# EAGLE schematic ESP32- 3.5 TFT Display(RGB)-V2.0 (EAGLE 9.5.1)
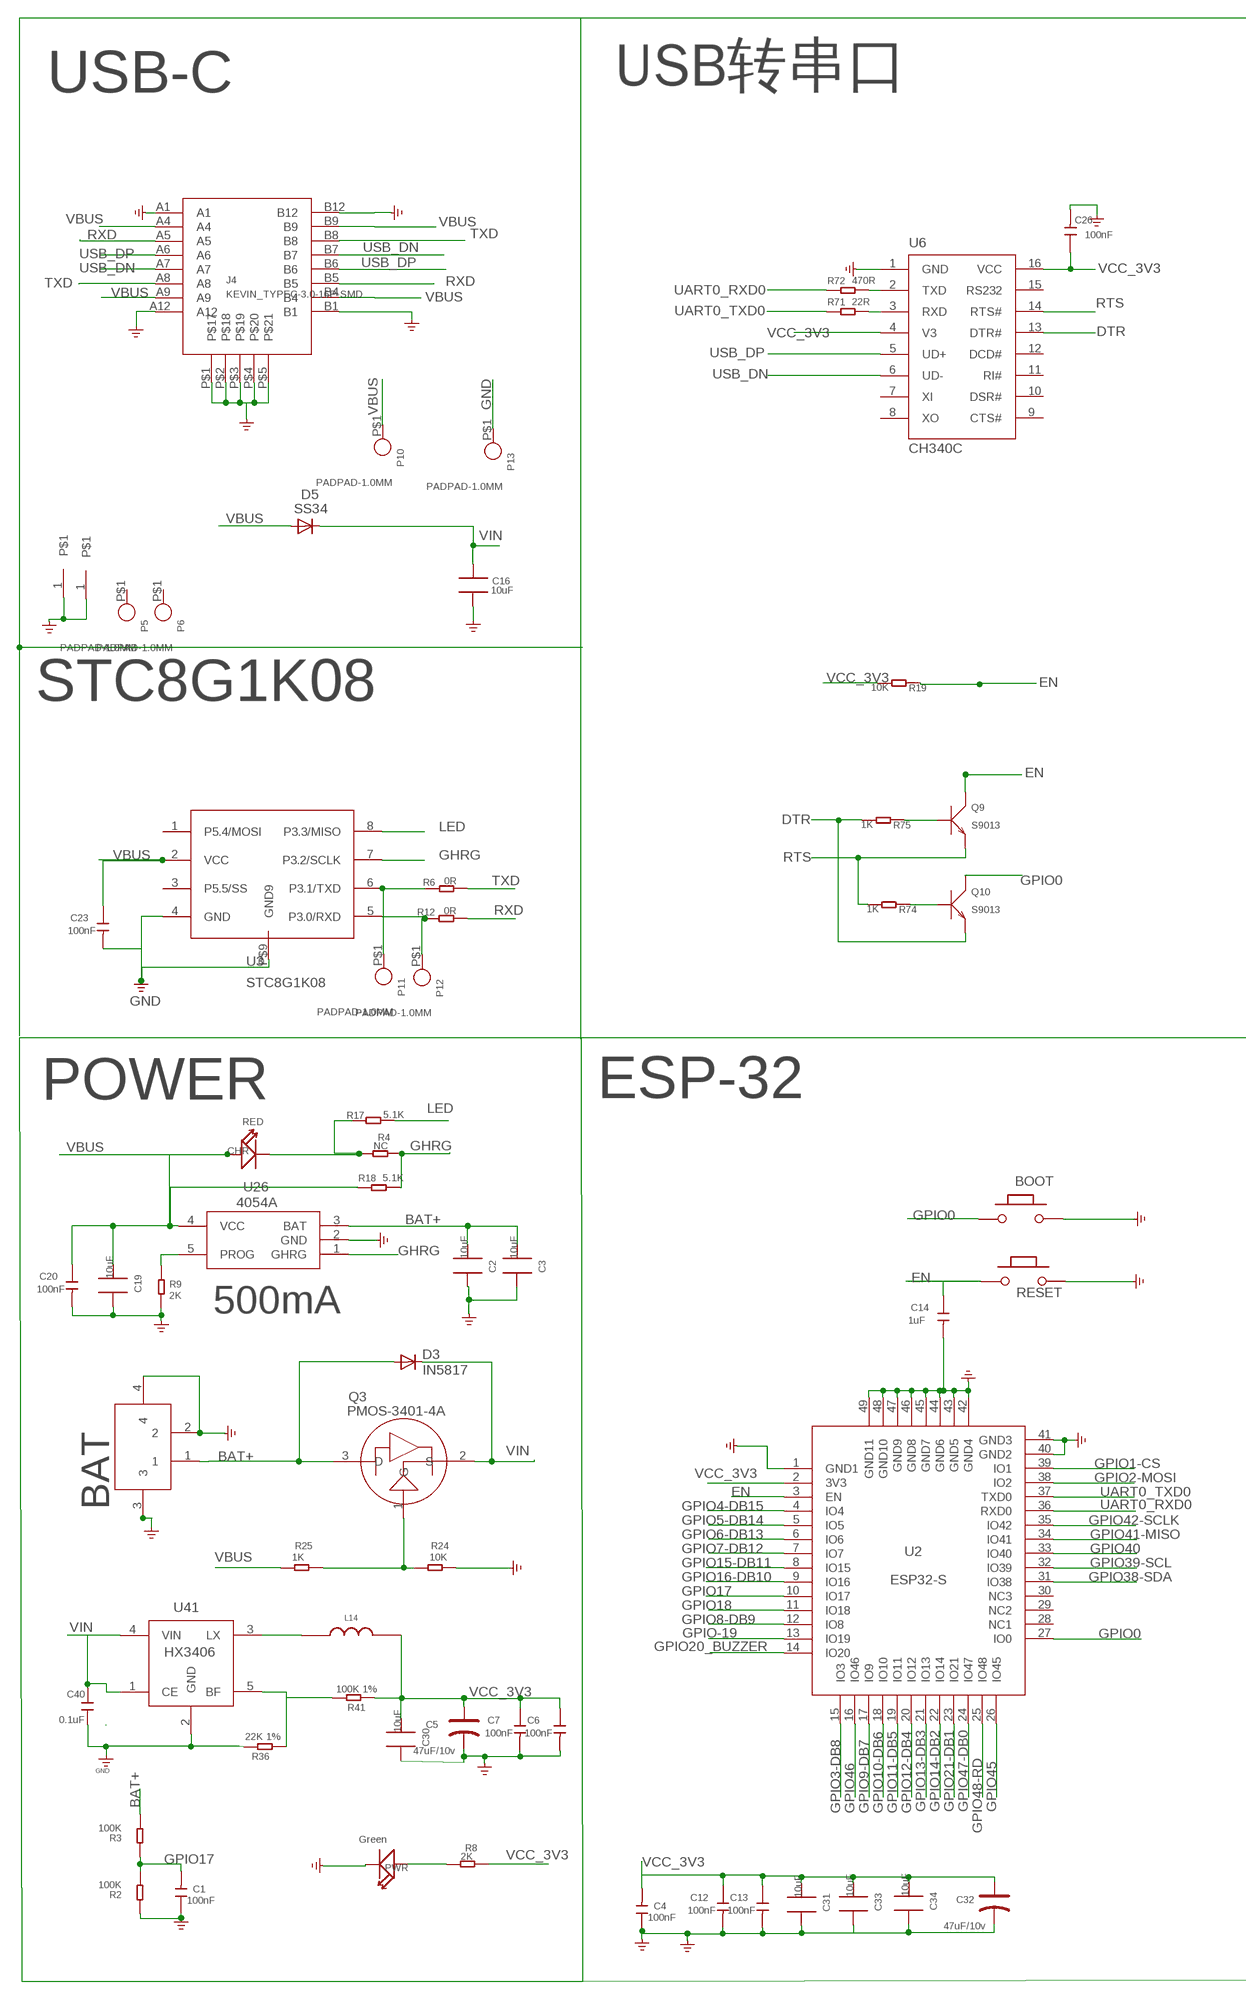
[diagram p0: schematic, sheet 1, part 1 of 2]
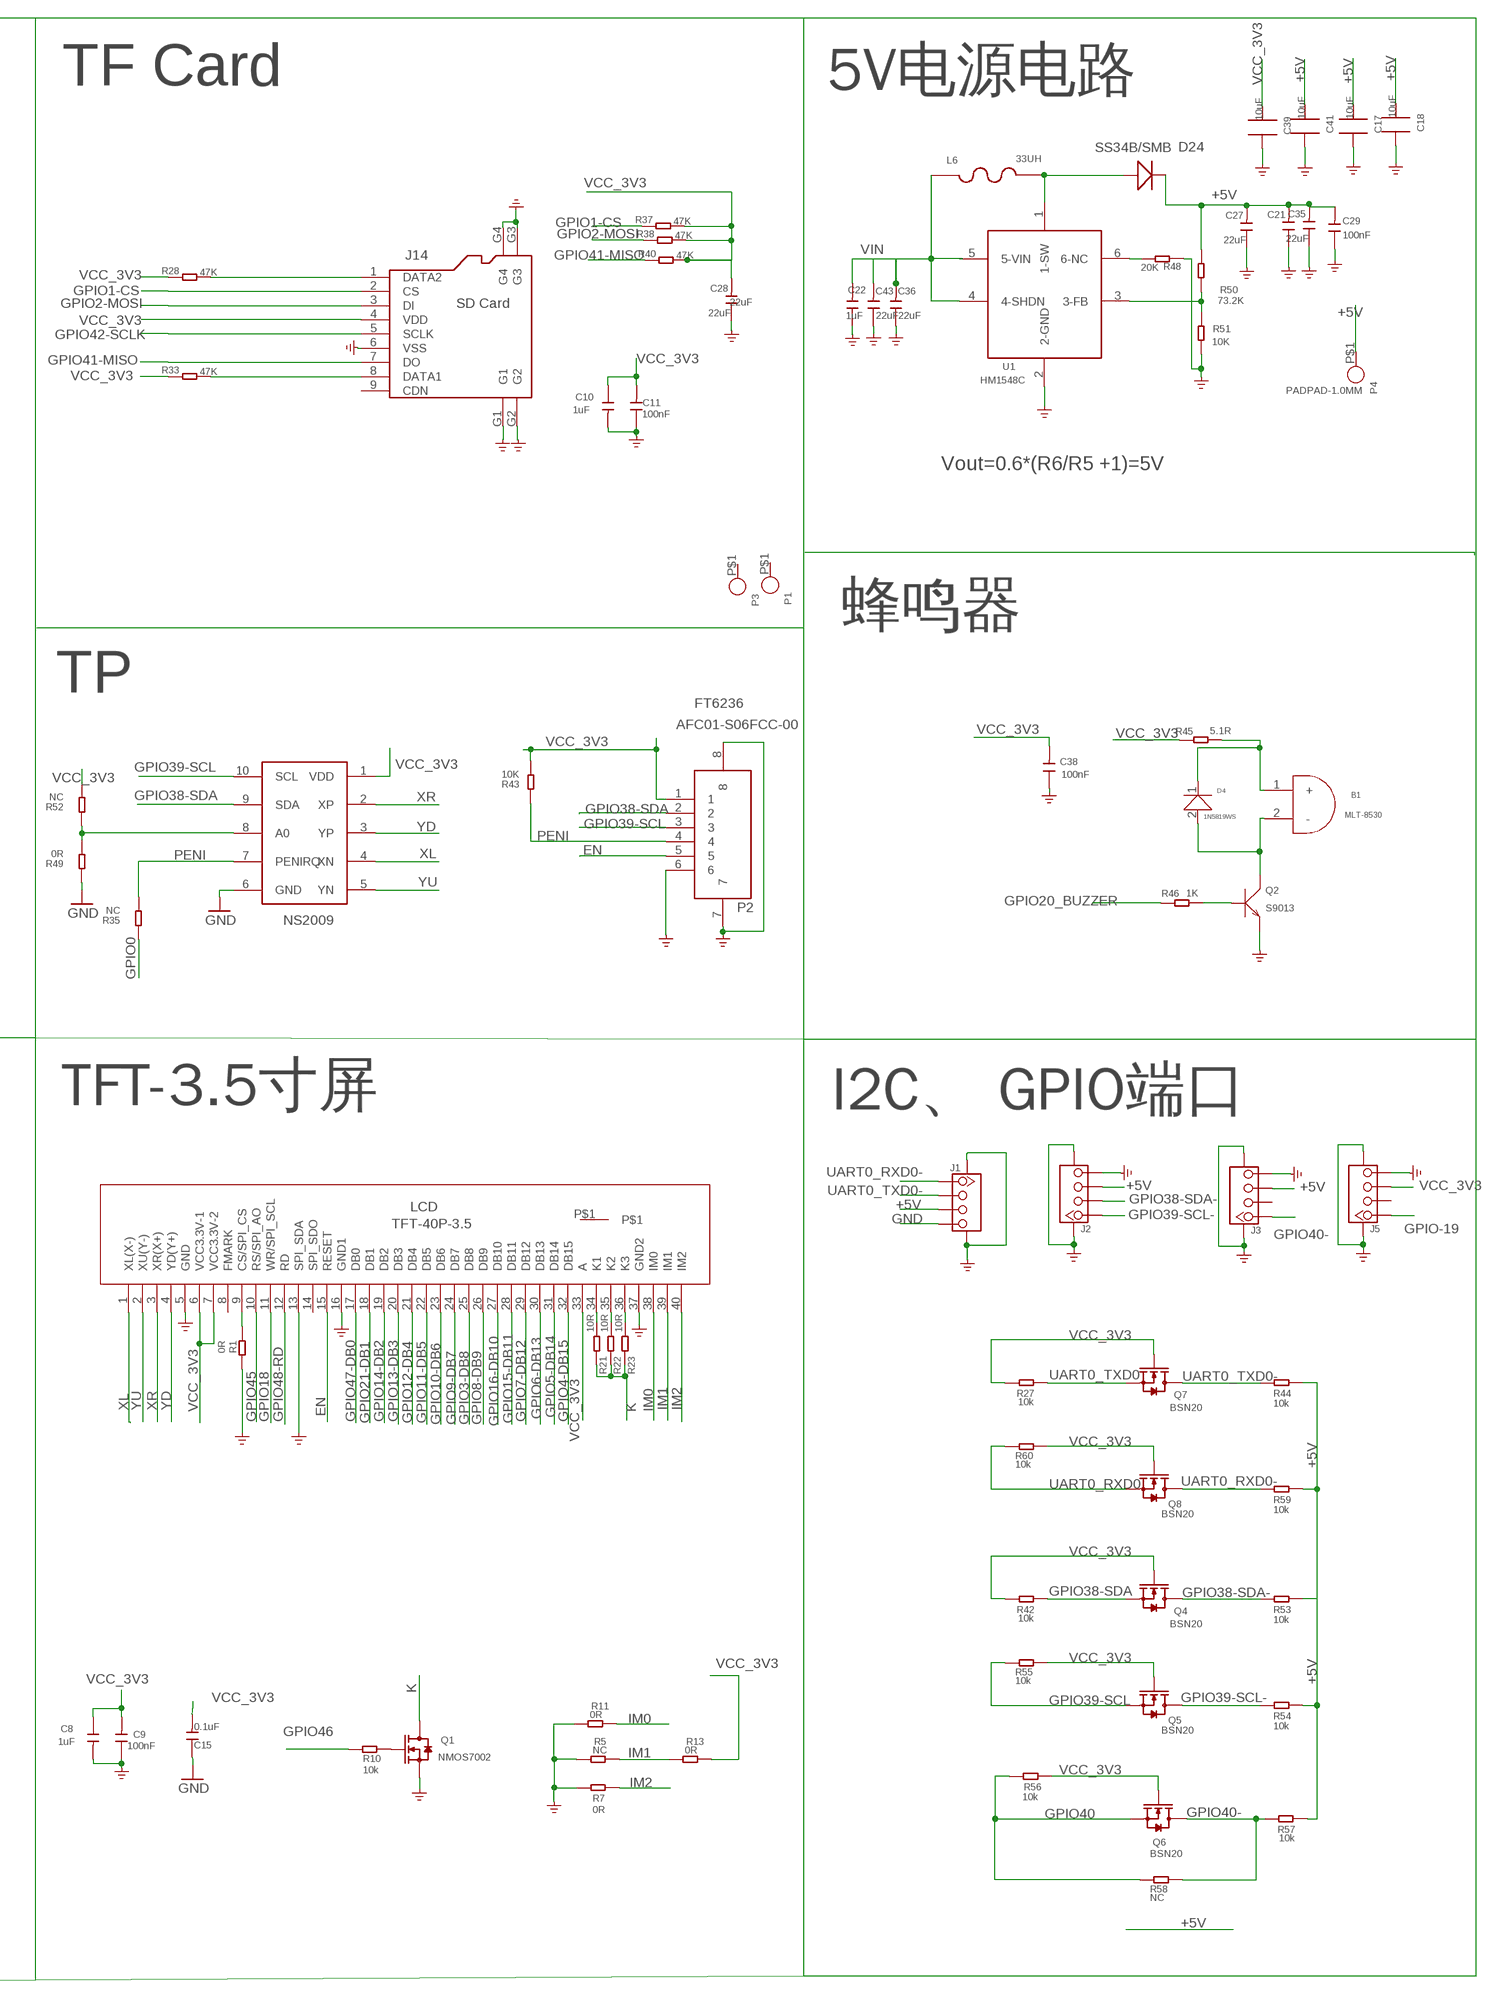
[diagram p1: schematic, sheet 1, part 2 of 2]

## Parts
B1  MLT-8530  [MLT-8530]
BAT  CON-80-2P-M  [2P-2.0-M]
BOOT  BUTTON  PB157  [157SW]
C1  100nF  C-0603  [C0603]
C2  10uF  C0805_S  [0805_S]
C3  10uF  C0805_S  [0805_S]
C4  100nF  C-0603  [C0603]
C5  47uF/10v  CAP-AVX-B  [AVX-B]
C6  100nF  C-0603  [C0603]
C7  100nF  C-0603  [C0603]
C8  1uF  C-0603  [C0603]
C9  100nF  C-0603  [C0603]
C10  1uF  C-0603  [C0603]
C11  100nF  C-0603  [C0603]
C12  100nF  C-0603  [C0603]
C13  100nF  C-0603  [C0603]
C14  1uF  C-0603  [C0603]
C15  0.1uF  DISCRETE_C-0603  [DISCRETE_C0603]
C16  10uF  C0805_S  [0805_S]
C17  10uF  C0805_S  [0805_S]
C18  10uF  C0805_S  [0805_S]
C19  10uF  C0805_S  [0805_S]
C20  100nF  C-0603  [C0603]
C21  22uF  C0805  [0805]
C22  1uF  C0603  [0603]
C23  100nF  C-0603  [C0603]
C26  100nF  C0603  [0603]
C27  22uF  C0805  [0805]
C28  22uF  C0805  [0805]
C29  100nF  C0603  [0603]
C30  10uF  C0805_S  [0805_S]
C31  10uF  C0805_S  [0805_S]
C32  47uF/10v  CAP-AVX-B  [AVX-B]
C33  10uF  C0805_S  [0805_S]
C34  10uF  C0805_S  [0805_S]
C35  22uF  C0805  [0805]
C36  22uF  C0805  [0805]
C38  100nF  DISCRETE_C-0603  [DISCRETE_C0603]
C39  10uF  C0805_S  [0805_S]
C40  0.1uF  C0603  [0603]
C41  10uF  C0805_S  [0805_S]
C43  22uF  C0805  [0805]
CHR  RED  LED'0603'  [LED-0603]
D3  IN5817  DIODE-DO-214AC  [DO-214AC]
D4  1N5819WS  [SOD-323]
D5  SS34  DIODE-DO-214AC  [DO-214AC]
D24  SS34B/SMB  214ABDO-214AB  [214AB]
J1  TWIG-4P-2.0-SMD-FEMALE-REINFORCE'90D'  [4P-SMD-2.0-90D]
J2  TWIG-4P-2.0-SMD-FEMALE-REINFORCE'90D'  [4P-SMD-2.0-90D]
J3  TWIG-4P-2.0-SMD-FEMALE-REINFORCE'90D'  [4P-SMD-2.0-90D]
J4  KEVIN_TYPEC-3.0-16P-SMD  [KEVIN_3.0TYPEC-SMD]
J5  TWIG-4P-2.0-SMD-FEMALE-REINFORCE'90D'  [4P-SMD-2.0-90D]
J14  SD Card  HOLDER-MICROSD-9P  [9P-SMD-W/-RING]
L6  33UH  L-773  [L773]
L14  CD32_950MA  [CD32]
LCD  TFT-40P-3.5  [TFT-3.5寸40PIN]
P1  PADPAD-1.0MM  [PAD-1.0MM]
P2  AFC01-S06FCC-00  [SMD8-50P-740L535W]
P3  PADPAD-1.0MM  [PAD-1.0MM]
P4  PADPAD-1.0MM  [PAD-1.0MM]
P5  PADPAD-1.0MM  [PAD-1.0MM]
P6  PADPAD-1.0MM  [PAD-1.0MM]
P10  PADPAD-1.0MM  [PAD-1.0MM]
P11  PADPAD-1.0MM  [PAD-1.0MM]
P12  PADPAD-1.0MM  [PAD-1.0MM]
P13  PADPAD-1.0MM  [PAD-1.0MM]
PWR  Green  LED'0603'  [LED-0603]
Q1  NMOS7002  MOSFET-N'SOT23'  [SOT23]
Q2  S9013  TRANSISTOR-NPN-SOT23  [SOT23@1]
Q3  PMOS-3401-4A  P-MOS-SOT23  [SOT-23]
Q4  BSN20  MOSFET-N'SOT23'  [SOT23]
Q5  BSN20  MOSFET-N'SOT23'  [SOT23]
Q6  BSN20  MOSFET-N'SOT23'  [SOT23]
Q7  BSN20  MOSFET-N'SOT23'  [SOT23]
Q8  BSN20  MOSFET-N'SOT23'  [SOT23]
Q9  S9013  TRANSISTOR-NPN-SOT23  [SOT23@1]
Q10  S9013  TRANSISTOR-NPN-SOT23  [SOT23@1]
R1  0R  R-0603  [R0603]
R2  100K  DISCRETE_R-0603  [DISCRETE_R0603]
R3  100K  DISCRETE_R-0603  [DISCRETE_R0603]
R4  NC  R-0603  [R0603]
R5  NC  R-0603  [R0603]
R6  0R  R0603  [R0603]
R7  0R  R-0603  [R0603]
R8  2K  R-0603  [R0603]
R9  2K  DISCRETE_R-0603  [DISCRETE_R0603]
R10  10k  R-0603  [R0603]
R11  0R  R-0603  [R0603]
R12  0R  R0603  [R0603]
R13  0R  R-0603  [R0603]
R17  5.1K  DISCRETE_R-0603  [DISCRETE_R0603]
R18  5.1K  DISCRETE_R-0603  [DISCRETE_R0603]
R19  10K  DISCRETE_R-0603  [DISCRETE_R0603]
R21  10R  R-0603  [R0603]
R22  10R  R-0603  [R0603]
R23  10R  R-0603  [R0603]
R24  10K  DISCRETE_R-0603  [DISCRETE_R0603]
R25  1K  DISCRETE_R-0603  [DISCRETE_R0603]
R27  10k  R-0603  [R0603]
R28  47K  R-0603  [R0603]
R33  47K  R-0603  [R0603]
R35  NC  DISCRETE_R-0603  [DISCRETE_R0603]
R36  22K 1%  R0603  [R0603]
R37  47K  R-0603  [R0603]
R38  47K  R-0603  [R0603]
R40  47K  R-0603  [R0603]
R41  100K 1%  R0603  [R0603]
R42  10k  R-0603  [R0603]
R43  10K  DISCRETE_R-0603  [DISCRETE_R0603]
R44  10k  R-0603  [R0603]
R45  5.1R  R0603  [R0603]
R46  1K  DISCRETE_R-0603  [DISCRETE_R0603]
R48  20K  DISCRETE_R-0603  [DISCRETE_R0603]
R49  0R  DISCRETE_R-0603  [DISCRETE_R0603]
R50  73.2K  DISCRETE_R-0603  [DISCRETE_R0603]
R51  10K  DISCRETE_R-0603  [DISCRETE_R0603]
R52  NC  DISCRETE_R-0603  [DISCRETE_R0603]
R53  10k  R-0603  [R0603]
R54  10k  R-0603  [R0603]
R55  10k  R-0603  [R0603]
R56  10k  R-0603  [R0603]
R57  10k  R-0603  [R0603]
R58  NC  R-0603  [R0603]
R59  10k  R-0603  [R0603]
R60  10k  R-0603  [R0603]
R71  22R  DISCRETE_R-0603  [DISCRETE_R0603]
R72  470R  DISCRETE_R-0603  [DISCRETE_R0603]
R74  1K  DISCRETE_R-0603  [DISCRETE_R0603]
R75  1K  DISCRETE_R-0603  [DISCRETE_R0603]
RESET  BUTTON  PB157  [157SW]
SM  TFT-3.5  [LCD3.5寸]
T1  3M-5  [3M-5]
T2  3M-5  [3M-5]
U1  HM1548C  HM1548/SOT23-6  [A_XBJ_SOT23-6]
U2  ESP32-S  [ESP32-S3]
U3  STC8G1K08  [DFN8]
U6  CH340C  CH340G  [SOP-16]
U8  NC\NS2009  NS2009  [MSOP10]
U26  4054A  [SOP23-5]
U41  HX3406  [SOT23-5]

## Nets
+5V: C17.2 C18.2 C21.2 C27.2 C29.2 C35.2 C41.2 D24.2(-) J1.3 J2.3 J3.3 P4.P$1 R44.2 R50.1 R53.2 R54.2 R57.2 R59.2
BAT+: BAT.1 C2.2 C3.2 D3.A Q3.3(D) R3.2 U26.3(BAT)
DTR: Q10.2(E) R75.2 U6.13(DTR#)
EN: C14.1 LCD.15(RESET) P2.5 Q9.3(C) R19.1 RESET.1 U2.3(EN)
GHRG: R4.2 R18.2 U3.7(P3.2/SCLK) U26.1(GHRG)
GND: BAT.2 BAT.3 BAT.4 BOOT.2 C1.1 C2.1 C3.1 C4.1 C5.- C6.2 C7.2 C8.2 C9.1 C10.2 C11.1 C12.2 C13.2 C14.2 C15.1 C16.1 C17.1 C18.1 C19.1 C20.2 C21.1 C22.1 C23.2 C26.2 C27.1 C28.1 C29.1 C30.1 C31.1 C32.- C33.1 C34.1 C35.1 C36.1 C38.1 C39.1 C40.2 C41.1 C43.1 J1.4 J1.SS1 J1.SS2 J2.4 J2.SS1 J2.SS2 J3.4 J3.SS1 J3.SS2 J4.A1 J4.A12 J4.B1 J4.B12 J4.P$1 J4.P$2 J4.P$3 J4.P$4 J4.P$5 J5.4 J5.SS1 J5.SS2 J14.6(VSS) J14.G1 J14.G2 J14.G3 J14.G4 LCD.5(GND) LCD.13(SPI_SDA) LCD.16(GND1) LCD.37(GND2) P2.6 P2.7 P2.8 P13.P$1 PWR.- Q1.2(S) Q2.2(E) R1.2 R2.1 R5.1 R7.1 R9.2 R11.1 R24.1 R36.1 R48.1 R49.1 R51.2 RESET.2 T1.1 T2.1 U1.2(2-GND) U2.1(GND1) U2.40(GND2) U2.41(GND3) U2.42(GND4) U2.43(GND5) U2.44(GND6) U2.45(GND7) U2.46(GND8) U2.47(GND9) U2.48(GND10) U2.49(GND11) U3.4(GND) U3.P$9(GND9) U6.1(GND) U8.6(GND) U26.2(GND) U41.2(GND)
GPIO0: BOOT.1 Q10.3(C) R35.1 U2.27(IO0)
GPIO1-CS: J14.2(CS) R37.1 U2.39(IO1)
GPIO2-MOSI: J14.3(DI) R38.1 U2.38(IO2)
GPIO3-DB8: LCD.25(DB8) U2.15(IO3)
GPIO4-DB15: LCD.32(DB15) U2.4(IO4)
GPIO5-DB14: LCD.31(DB14) U2.5(IO5)
GPIO6-DB13: LCD.30(DB13) U2.6(IO6)
GPIO7-DB12: LCD.29(DB12) U2.7(IO7)
GPIO8-DB9: LCD.26(DB9) U2.12(IO8)
GPIO9-DB7: LCD.24(DB7) U2.17(IO9)
GPIO10-DB6: LCD.23(DB6) U2.18(IO10)
GPIO11-DB5: LCD.22(DB5) U2.19(IO11)
GPIO12-DB4: LCD.21(DB4) U2.20(IO12)
GPIO13-DB3: LCD.20(DB3) U2.21(IO13)
GPIO14-DB2: LCD.19(DB2) U2.22(IO14)
GPIO15-DB11: LCD.28(DB11) U2.8(IO15)
GPIO16-DB10: LCD.27(DB10) U2.9(IO16)
GPIO17: C1.2 R2.2 R3.1 U2.10(IO17)
GPIO18: LCD.11(WR/SPI_SCL) U2.11(IO18)
GPIO20_BUZZER: R46.1 U2.14(IO20)
GPIO21-DB1: LCD.18(DB1) U2.23(IO21)
GPIO38-SDA: P2.2 Q4.2(S) R42.2 U2.31(IO38) U8.9(SDA)
GPIO38-SDA-: J2.2 Q4.3(D) R53.1
GPIO39-SCL: P2.3 Q5.2(S) R55.1 U2.32(IO39) U8.10(SCL)
GPIO39-SCL-: J2.1 Q5.3(D) R54.1
GPIO40: Q6.2(S) R56.1 R58.1 U2.33(IO40)
GPIO40-: J3.1 Q6.3(D) R57.1 R58.2
GPIO41-MISO: J14.7(DO) R40.1 U2.34(IO41)
GPIO42-SCLK: J14.5(SCLK) U2.35(IO42)
GPIO45: LCD.10(RS/SPI_AO) U2.26(IO45)
GPIO46: R10.1 U2.16(IO46)
GPIO47-DB0: LCD.17(DB0) U2.24(IO47)
GPIO48-RD: LCD.12(RD) U2.25(IO48)
GPIO-19: J5.1 U2.13(IO19)
IM0: LCD.38(IM0) R11.2
IM1: LCD.39(IM1) R5.2 R13.1
IM2: LCD.40(IM2) R7.2
K: Q1.3(D) R21.1 R22.1 R23.1
LED: R17.2 U3.8(P3.3/MISO)
N$3: Q1.1(G) R10.2
N$4: J14.1(DATA2) R28.2
N$5: PWR.+ R8.1
N$6: LCD.34(K1) R21.2
N$7: LCD.35(K2) R22.2
N$8: B1.2(-) D4.2(+) Q2.3(C)
N$9: LCD.36(K3) R23.2
N$10: LCD.9(CS/SPI_CS) R1.1
N$11: CHR.- R4.1 R17.1
N$12: D24.1(+) L6.2 U1.1(1-SW)
N$13: B1.1(+) D4.1(-) R45.2
N$14: R9.1 U26.5(PROG)
N$16: P11.P$1 R6.2 U3.6(P3.1/TXD)
N$17: Q3.1(G) R24.2 R25.1
N$18: P12.P$1 R12.2 U3.5(P3.0/RXD)
N$23: J14.8(DATA1) R33.2
N$25: R49.2 R52.1 U8.8(A0)
N$27: L14.1 U41.3(LX)
N$30: R50.2 R51.1 U1.3(3-FB)
N$31: R48.2 U1.6(6-NC)
N$32: Q9.1(B) R75.1
N$33: R36.2 R41.1 U41.5(BF)
N$34: Q2.1(B) R46.2
N$38: Q10.1(B) R74.1
N$40: R72.2 U6.2(TXD)
N$42: R71.2 U6.3(RXD)
PENI: P2.4 R35.2 R43.1 U8.7(PENIRQ)
RTS: Q9.2(E) R74.2 U6.14(RTS#)
RXD: J4.A5 J4.B5 R12.1
TXD: J4.A8 J4.B8 R6.1
UART0_RXD0: Q8.2(S) R60.1 R72.1 U2.36(RXD0)
UART0_RXD0-: J1.1 Q8.3(D) R59.1
UART0_TXD0: Q7.2(S) R27.2 R71.1 U2.37(TXD0)
UART0_TXD0-: J1.2 Q7.3(D) R44.1
USB_DN: J4.A7 J4.B7 U6.6(UD-)
USB_DP: J4.A6 J4.B6 U6.5(UD+)
VBUS: C19.2 C20.1 C23.1 CHR.+ D5.A J4.A4 J4.A9 J4.B4 J4.B9 P10.P$1 R18.1 R25.2 U3.2(VCC) U26.4(VCC)
VCC_3V3: C4.2 C5.+ C6.1 C7.1 C8.1 C9.2 C10.1 C11.2 C12.1 C13.1 C15.2 C26.1 C28.2 C30.2 C31.2 C32.+ C33.2 C34.2 C38.2 C39.2 J5.3 J14.4(VDD) L14.2 LCD.6(VCC3.3V-1) LCD.7(VCC3.3V-2) LCD.33(A) P2.1 Q4.1(G) Q5.1(G) Q6.1(G) Q7.1(G) Q8.1(G) R8.2 R13.2 R19.2 R27.1 R28.1 R33.1 R37.2 R38.2 R40.2 R41.2 R42.1 R43.2 R45.1 R52.2 R55.2 R56.2 R60.2 U2.2(3V3) U6.4(V3) U6.16(VCC) U8.1(VDD)
VIN: C16.2 C22.2 C36.2 C40.1 C43.2 D3.C D5.C L6.1 Q3.2(S) U1.4(4-SHDN) U1.5(5-VIN) U41.1(CE) U41.4(VIN)
XL: LCD.1(XL(X-)) U8.4(XN)
XR: LCD.3(XR(X+)) U8.2(XP)
YD: LCD.4(YD(Y+)) U8.3(YP)
YU: LCD.2(XU(Y-)) U8.5(YN)
Unconnected: J3.2 J5.2 J14.9(CDN) LCD.8(FMARK) LCD.14(SPI_SDO) P1.P$1 P3.P$1 P5.P$1 P6.P$1 SM.P$1 U2.28(NC1) U2.29(NC2) U2.30(NC3) U3.1(P5.4/MOSI) U3.3(P5.5/SS) U6.7(XI) U6.8(XO) U6.9(CTS#) U6.10(DSR#) U6.11(RI#) U6.12(DCD#) U6.15(RS232)

## Notes on the sheet
- USB-C | USB转串口 | TF Card | 5V电源电路
- Vout=0.6*(R6/R5 +1)=5V
- 蜂鸣器
- STC8G1K08 | TP
- FT6236
- NS2009
- POWER | ESP-32 | TFT-3.5寸屏 | I2C、 GPIO端口
- 500mA
- BAT

## Library data of the parts
B1 = A_xbj:MLT-8530
BAT = DW1000:CON-80-2P-M
BOOT RESET = MySMD:PB157
C1 C4 C6-C14 C20 C23 = discrete:C*: Ceramic Capacitors
C2 C3 C16-C19 C30 C31 C33 C34 C39 C41 = CPT_SMD:C0805
C5 C32 = discrete:CAP*: Electrolytic Capacitors,Tantalum Capacitors and Super Capacitors
C15 = A9G:DISCRETE_C*: Ceramic Capacitors
C21 C27 C28 C35 C36 C43 = A_xbj:C0805
C22 C26 C29 = A_xbj:C0603
C38 = A_xbj:DISCRETE_C*: Ceramic Capacitors
C40 = cooper:C0603
CHR PWR = discrete:LED*
D3 D5 = diode:DIODE-: DIODE
D4 = A_xbj:1N5819WS
D24 = DO-214AB:214AB: 214AB
J1-J3 J5 = Connector:TWIG-4P-2.0-SMD-FEMALE-REINFORCE
J4 = untitled:KEVIN_TYPEC-3.0-16P-SMD
J14 = Connector:HOLDER-MICROSD-9P
L6 = crowpi_pow:L-773
L14 = CD54:CD32_950MA
LCD = DW1000:TFT-40P-3.5: XL(X-)
P1 P3-P6 P10-P13 = crowpi_pow:PAD*
P2 = self:AFC01-S06FCC-00
Q1 Q4-Q8 = discrete:MOSFET-N: IRLL014: http://www.vishay.com/docs/91319/sihll014.pdf
Q2 Q9 Q10 = discrete:TRANSISTOR-NPN*: NPN audion
Q3 = DFN8:P-MOS-SOT23
R1 R4 R5 R7 R8 R10 R11 R13 R21-R23 R27 R28 R33 R37 R38 R40 R42 R44 R53-R60 = discrete:R*
R2 R3 R9 R24 R25 R35 R43 R49 R52 = A9G:DISCRETE_R*
R6 R12 R36 R41 = cooper:R0603
R17-R19 R46 R48 R50 R51 R71 R72 R74 R75 = Crowtail-_LED-V2.0-20190615-01:DISCRETE_R*
R45 = A_xbj:R0603
SM = DW1000:TFT-3.5
T1 T2 = DW1000:3M-5
U1 = CrowBOT-V1.0-20220530库:HM1548/SOT23-6
U2 = DW1000:ESP32-S
U3 = DFN8:STC8G1K08
U6 = A_xbj:CH340G
U8 = NS2009:NS2009
U26 = DFN8:4054A
U41 = DFN8:HX3406

## Net classes
0 default: width 0.127 mm, drill 0.203 mm, clearance 0.203 mm
1 New Class: width 0.127 mm, drill 0.203 mm, clearance 0.203 mm to class 0, clearance 0.203 mm